# Altium schematic sheet Power.SchDoc: =documentname
size 279 x 215 mm; CheckedBy: TBD; Engineer: Yuchen Lin; Organization: UW Robotics; Address1: 200 University Avenue; Address2: Waterloo; Address3: Ontario; Address4: Canada N2L 3G6; DocumentNumber: 1; Revision: 1.0; SheetNumber: 1; SheetTotal: 2; designer: Yuchen Lin; reviewer: TBD; total sheets: 2; version: 1.0
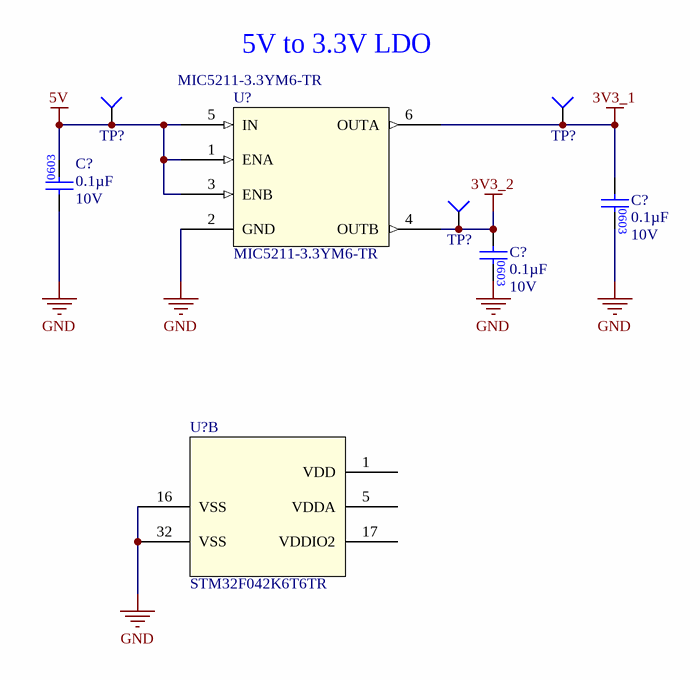
[diagram p0: Power.SchDoc]

## Parts
(Parts that share a designator on the sheet are numbered #1, #2 ... from top to bottom, then left to right.)
C?#1  value 0.1µF  Voltage Rating: 10V  [CAP0603]  (hidden comment: CAP_0.1uF_10V_0603)
C?#2  value 0.1µF  Voltage Rating: 10V  [CAP0603]  (hidden comment: CAP_0.1uF_10V_0603)
C?#3  value 0.1µF  Voltage Rating: 10V  [CAP0603]  (hidden comment: CAP_0.1uF_10V_0603)
TP?#1  TESTPOINT_SMD_LOOP  [S1751-46R]  (value not drawn)
TP?#2  TESTPOINT_SMD_LOOP  [S1751-46R]  (value not drawn)
TP?#3  TESTPOINT_SMD_LOOP  [S1751-46R]  (value not drawn)
U?#1  MIC5211-3.3YM6-TR  [SOT-23-6_M6_MCH]
U?#2  STM32F042K6T6TR  [LQFP-32]  (part B of 2)

## Nets
3V3_1: C?#1.1 TP?#2.1(=value) U?#1.6(OUTA)
3V3_2: C?#3.1 TP?#3.1(=value) U?#1.4(OUTB)
5V: C?#2.2 TP?#1.1(=value) U?#1.1(ENA) U?#1.3(ENB) U?#1.5(IN)
GND: C?#1.2 C?#2.1 C?#3.2 U?#1.2(GND) U?#2.16(VSS) U?#2.32(VSS)

Not connected (* = marked no-connect by the designer): U?#2 1(VDD) 5(VDDA) 17(VDDIO2)

## Notes on the sheet
- (near U?#1) 5V to 3.3V LDO
- University of Waterloo Robotics Team
- 200 University Ave W
- REV
- PROJECT
- Waterloo, Ontario, Canada
- N2L 3G1
- DOCUMENT
- ENGINEER
- REVIEWER
- MODIFIED
- SHEET
- OF
- (in symbol CAP_0.1uF_10V_0603) 0603

## Library data of the parts
C?#1-C?#3 = CAP_0.1uF_10V_0603: CAP CER 0.1UF 10V X7R 0402; Manufacturer 1: Murata Electronics; Manufacturer Part Number 1: GRM155R71A104KA01D; Package/Footprint: 0402; Supplier 1: Digi-Key; Supplier Part Number 1: 490-6321-1-ND
TP?#1-TP?#3 = TESTPOINT_SMD_LOOP: TESTPOINT SMD LOOP; Manufacturer 1: Harwin; Supplier 1: Digi-Key; Manufacturer Part Number 1: S1751-46R; Mounting Type: SMD; Package/Footprint: SMD; Supplier Part Number 1: 952-1478-1-ND
U?#1 = MIC5211-3.3YM6-TR: Linear Voltage Regulator IC Positive Fixed 2 Output 80mA, 80mA SOT-23-6; Mfr_Name: Microchip; Voltage - Input (Max): 16; Output Type: 3.3V; Package / Case: SOT-23-6; ComponentLink1Description: digikey; ComponentLink1URL: https://www.digikey.ca/en/products/detail/microchip-technology/MIC5211-3-3YM6-TR/1616942; Supplier 1: Arrow Electronics; Supplier Part Number 1: MIC5211-3.3YM6-TR
U?#2 = STM32F042K6T6TR: No Description Available; Mfr_Name: STMicroelectronics; Core Processor: ARM® Cortex®-M0; Program Memory Size: 32KB (32K x 8); Program Memory Type: FLASH; Package / Case: 32-LQFP; Base Product Number: STM32F042; ComponentLink1Description: digikey; ComponentLink1URL: https://www.digikey.com/en/products/detail/stmicroelectronics/STM32F042K6T6TR/10414582; Supplier 1: Avnet; Supplier Part Number 1: 16AC3527